# Altium schematic sheet FPGA_SDRAM2.SchDoc: RFSOC_AMC
size 420 x 297 mm; Author: G.Kasprowicz; CompanyName: WUT ISE; DrawnBy: G.Kasprowicz; Organization: WUT ISE; Address1: PW ISE; Address2: Nowowiejska 15/19 00-665 Warsaw; Address3: gkasprow@gmail.com; DocumentNumber: 13; Revision: 2; SheetNumber: 14; SheetTotal: 54; ModifiedBy: -; CheckedDate: -; Title2: 8 channel ADC & DAC; DivGrp: WUT ISE; Designer: G.Kasprowicz; ModifiedDate: -; ProjectName: Sensor Box
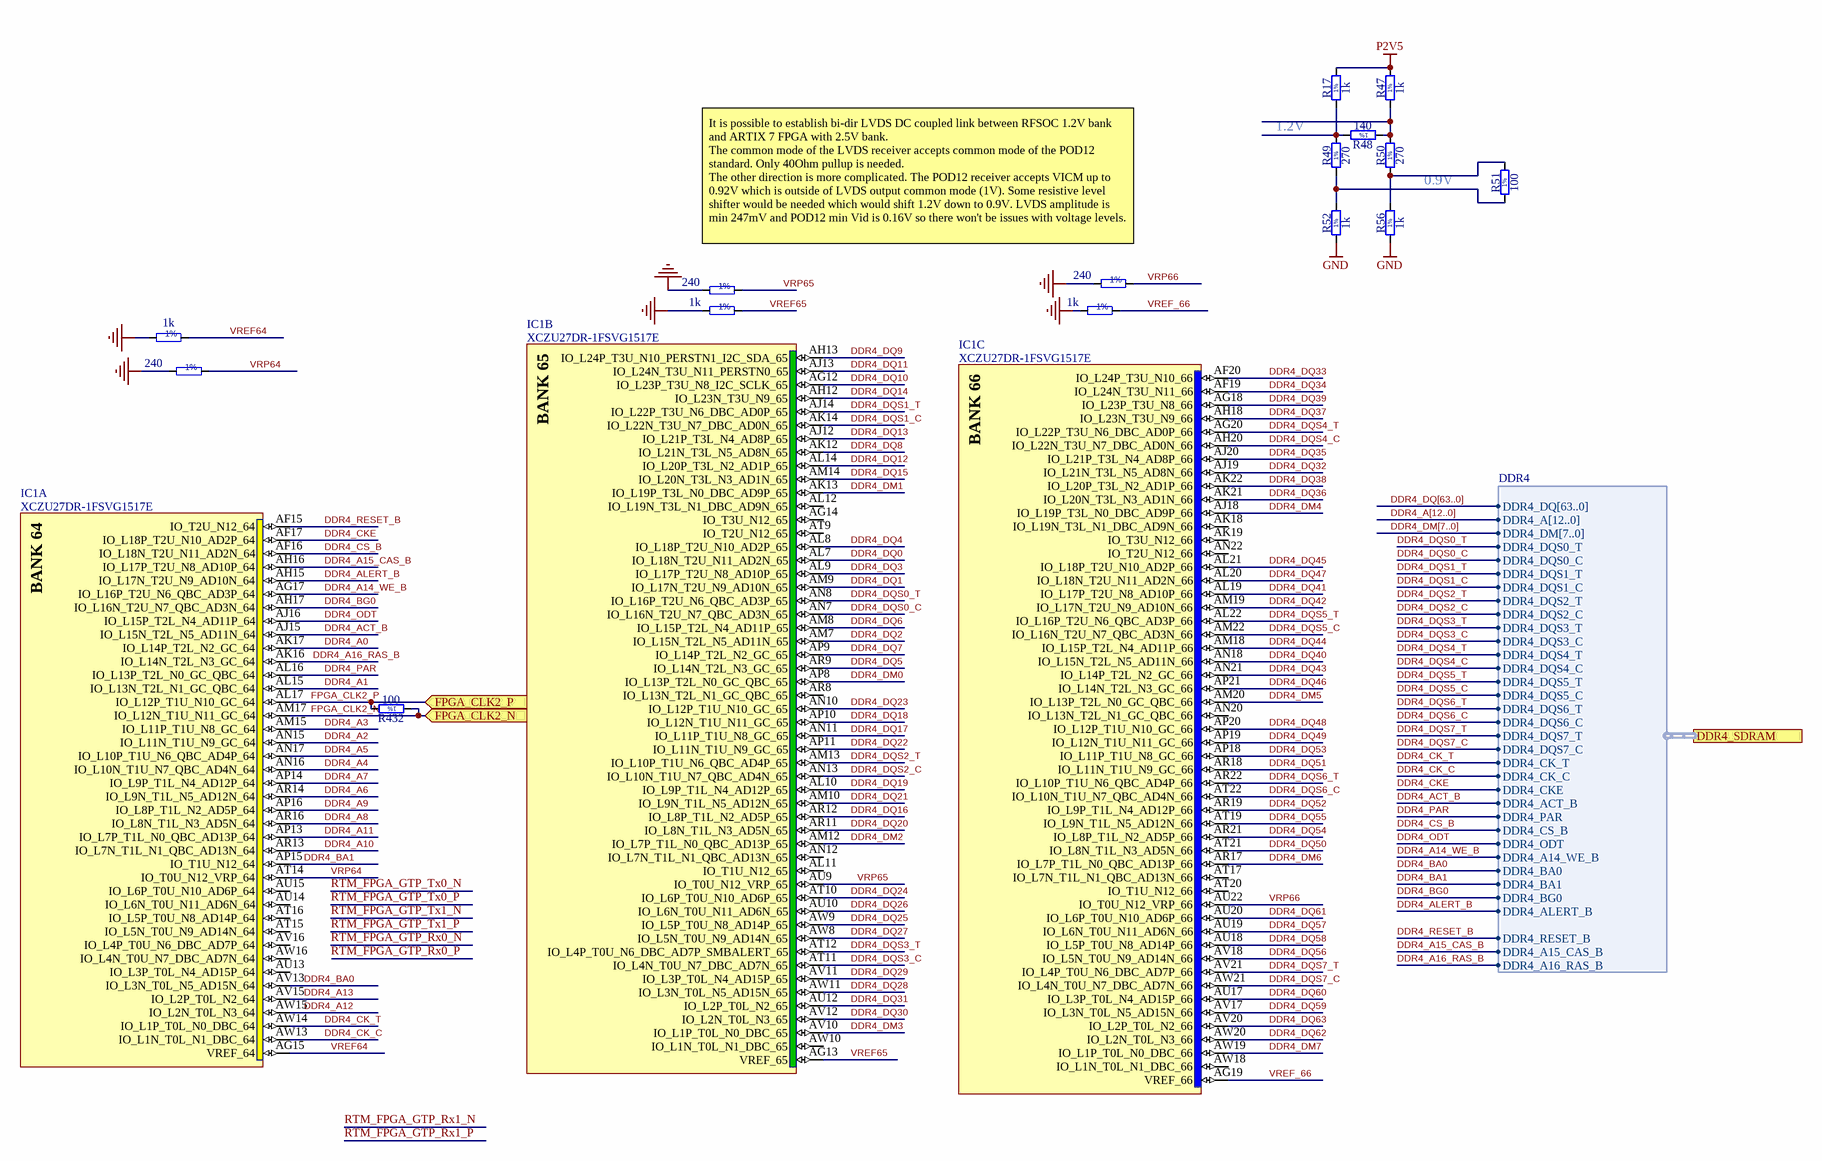
[diagram p0: FPGA_SDRAM2.SchDoc]

## Parts
IC1  XCZU27DR-1FSVG1517E  [XILINX_FSVG1517 (XCZU27DR)]  (parts A,B,C of 31)
R1  1k
R2  240
R3  240
R4  240
R5  1k
R6  1k
R17  1k  [RESC1005X40N]
R47  1k  [RESC1005X40N]
R48  140  [RESC1005X40N]
R49  270  [RESC1005X40N]
R50  270  [RESC1005X40N]
R51  100  [RESC1005X40N]
R52  1k  [RESC1005X40N]
R56  1k  [RESC1005X40N]
R432  100  [RESC1005X40N]

## Ports
DDR4_SDRAM (harness DDR4), FPGA_CLK2_N (in), FPGA_CLK2_P (in)

## Harnesses
DDR4: DDR4_DQ[63..0], DDR4_A[12..0], DDR4_DM[7..0], DDR4_DQS0_T, DDR4_DQS0_C, DDR4_DQS1_T, DDR4_DQS1_C, DDR4_DQS2_T, DDR4_DQS2_C, DDR4_DQS3_T, DDR4_DQS3_C, DDR4_DQS4_T, DDR4_DQS4_C, DDR4_DQS5_T, DDR4_DQS5_C, DDR4_DQS6_T, DDR4_DQS6_C, DDR4_DQS7_T, DDR4_DQS7_C, DDR4_CK_T, DDR4_CK_C, DDR4_CKE, DDR4_ACT_B, DDR4_PAR, DDR4_CS_B, DDR4_ODT, DDR4_A14_WE_B, DDR4_BA0, DDR4_BA1, DDR4_BG0, DDR4_ALERT_B, DDR4_RESET_B, DDR4_A15_CAS_B, DDR4_A16_RAS_B

## Nets
GND: R1.1 R2.1 R3.1 R4.1 R5.1 R6.1 R52.1 R56.1
P2V5: R17.2 R47.2
DDR4_A0: IC1.AK17(IO_L14P_T2L_N2_GC_64)
DDR4_A1: IC1.AL15(IO_L13N_T2L_N1_GC_QBC_64)
DDR4_A2: IC1.AN15(IO_L11N_T1U_N9_GC_64)
DDR4_A3: IC1.AM15(IO_L11P_T1U_N8_GC_64)
DDR4_A4: IC1.AN16(IO_L10N_T1U_N7_QBC_AD4N_64)
DDR4_A5: IC1.AN17(IO_L10P_T1U_N6_QBC_AD4P_64)
DDR4_A6: IC1.AR14(IO_L9N_T1L_N5_AD12N_64)
DDR4_A7: IC1.AP14(IO_L9P_T1L_N4_AD12P_64)
DDR4_A8: IC1.AR16(IO_L8N_T1L_N3_AD5N_64)
DDR4_A9: IC1.AP16(IO_L8P_T1L_N2_AD5P_64)
DDR4_A10: IC1.AR13(IO_L7N_T1L_N1_QBC_AD13N_64)
DDR4_A11: IC1.AP13(IO_L7P_T1L_N0_QBC_AD13P_64)
DDR4_A12: IC1.AW15(IO_L2N_T0L_N3_64)
DDR4_A13: IC1.AV15(IO_L2P_T0L_N2_64)
DDR4_A14_WE_B: IC1.AG17(IO_L16P_T2U_N6_QBC_AD3P_64) ; port DDR4_SDRAM.DDR4_A14_WE_B
DDR4_A15_CAS_B: IC1.AH16(IO_L17P_T2U_N8_AD10P_64) ; port DDR4_SDRAM.DDR4_A15_CAS_B
DDR4_A16_RAS_B: IC1.AK16(IO_L14N_T2L_N3_GC_64) ; port DDR4_SDRAM.DDR4_A16_RAS_B
DDR4_ACT_B: IC1.AJ15(IO_L15N_T2L_N5_AD11N_64) ; port DDR4_SDRAM.DDR4_ACT_B
DDR4_ALERT_B: IC1.AH15(IO_L17N_T2U_N9_AD10N_64) ; port DDR4_SDRAM.DDR4_ALERT_B
DDR4_BA0: IC1.AV13(IO_L3N_T0L_N5_AD15N_64) ; port DDR4_SDRAM.DDR4_BA0
DDR4_BA1: IC1.AP15(IO_T1U_N12_64) ; port DDR4_SDRAM.DDR4_BA1
DDR4_BG0: IC1.AH17(IO_L16N_T2U_N7_QBC_AD3N_64) ; port DDR4_SDRAM.DDR4_BG0
DDR4_CK_C: IC1.AW13(IO_L1N_T0L_N1_DBC_64) ; port DDR4_SDRAM.DDR4_CK_C
DDR4_CK_T: IC1.AW14(IO_L1P_T0L_N0_DBC_64) ; port DDR4_SDRAM.DDR4_CK_T
DDR4_CKE: IC1.AF17(IO_L18P_T2U_N10_AD2P_64) ; port DDR4_SDRAM.DDR4_CKE
DDR4_CS_B: IC1.AF16(IO_L18N_T2U_N11_AD2N_64) ; port DDR4_SDRAM.DDR4_CS_B
DDR4_DM0: IC1.AP8(IO_L13P_T2L_N0_GC_QBC_65)
DDR4_DM1: IC1.AK13(IO_L19P_T3L_N0_DBC_AD9P_65)
DDR4_DM2: IC1.AM12(IO_L7P_T1L_N0_QBC_AD13P_65)
DDR4_DM3: IC1.AV10(IO_L1P_T0L_N0_DBC_65)
DDR4_DM4: IC1.AJ18(IO_L19P_T3L_N0_DBC_AD9P_66)
DDR4_DM5: IC1.AM20(IO_L13P_T2L_N0_GC_QBC_66)
DDR4_DM6: IC1.AR17(IO_L7P_T1L_N0_QBC_AD13P_66)
DDR4_DM7: IC1.AW19(IO_L1P_T0L_N0_DBC_66)
DDR4_DQ0: IC1.AL7(IO_L18N_T2U_N11_AD2N_65)
DDR4_DQ1: IC1.AM9(IO_L17N_T2U_N9_AD10N_65)
DDR4_DQ2: IC1.AM7(IO_L15N_T2L_N5_AD11N_65)
DDR4_DQ3: IC1.AL9(IO_L17P_T2U_N8_AD10P_65)
DDR4_DQ4: IC1.AL8(IO_L18P_T2U_N10_AD2P_65)
DDR4_DQ5: IC1.AR9(IO_L14N_T2L_N3_GC_65)
DDR4_DQ6: IC1.AM8(IO_L15P_T2L_N4_AD11P_65)
DDR4_DQ7: IC1.AP9(IO_L14P_T2L_N2_GC_65)
DDR4_DQ8: IC1.AK12(IO_L21N_T3L_N5_AD8N_65)
DDR4_DQ9: IC1.AH13(IO_L24P_T3U_N10_PERSTN1_I2C_SDA_65)
DDR4_DQ10: IC1.AG12(IO_L23P_T3U_N8_I2C_SCLK_65)
DDR4_DQ11: IC1.AJ13(IO_L24N_T3U_N11_PERSTN0_65)
DDR4_DQ12: IC1.AL14(IO_L20P_T3L_N2_AD1P_65)
DDR4_DQ13: IC1.AJ12(IO_L21P_T3L_N4_AD8P_65)
DDR4_DQ14: IC1.AH12(IO_L23N_T3U_N9_65)
DDR4_DQ15: IC1.AM14(IO_L20N_T3L_N3_AD1N_65)
DDR4_DQ16: IC1.AR12(IO_L8P_T1L_N2_AD5P_65)
DDR4_DQ17: IC1.AN11(IO_L11P_T1U_N8_GC_65)
DDR4_DQ18: IC1.AP10(IO_L12N_T1U_N11_GC_65)
DDR4_DQ19: IC1.AL10(IO_L9P_T1L_N4_AD12P_65)
DDR4_DQ20: IC1.AR11(IO_L8N_T1L_N3_AD5N_65)
DDR4_DQ21: IC1.AM10(IO_L9N_T1L_N5_AD12N_65)
DDR4_DQ22: IC1.AP11(IO_L11N_T1U_N9_GC_65)
DDR4_DQ23: IC1.AN10(IO_L12P_T1U_N10_GC_65)
DDR4_DQ24: IC1.AT10(IO_L6P_T0U_N10_AD6P_65)
DDR4_DQ25: IC1.AW9(IO_L5P_T0U_N8_AD14P_65)
DDR4_DQ26: IC1.AU10(IO_L6N_T0U_N11_AD6N_65)
DDR4_DQ27: IC1.AW8(IO_L5N_T0U_N9_AD14N_65)
DDR4_DQ28: IC1.AW11(IO_L3N_T0L_N5_AD15N_65)
DDR4_DQ29: IC1.AV11(IO_L3P_T0L_N4_AD15P_65)
DDR4_DQ30: IC1.AV12(IO_L2N_T0L_N3_65)
DDR4_DQ31: IC1.AU12(IO_L2P_T0L_N2_65)
DDR4_DQ32: IC1.AJ19(IO_L21N_T3L_N5_AD8N_66)
DDR4_DQ33: IC1.AF20(IO_L24P_T3U_N10_66)
DDR4_DQ34: IC1.AF19(IO_L24N_T3U_N11_66)
DDR4_DQ35: IC1.AJ20(IO_L21P_T3L_N4_AD8P_66)
DDR4_DQ36: IC1.AK21(IO_L20N_T3L_N3_AD1N_66)
DDR4_DQ37: IC1.AH18(IO_L23N_T3U_N9_66)
DDR4_DQ38: IC1.AK22(IO_L20P_T3L_N2_AD1P_66)
DDR4_DQ39: IC1.AG18(IO_L23P_T3U_N8_66)
DDR4_DQ40: IC1.AN18(IO_L15N_T2L_N5_AD11N_66)
DDR4_DQ41: IC1.AL19(IO_L17P_T2U_N8_AD10P_66)
DDR4_DQ42: IC1.AM19(IO_L17N_T2U_N9_AD10N_66)
DDR4_DQ43: IC1.AN21(IO_L14P_T2L_N2_GC_66)
DDR4_DQ44: IC1.AM18(IO_L15P_T2L_N4_AD11P_66)
DDR4_DQ45: IC1.AL21(IO_L18P_T2U_N10_AD2P_66)
DDR4_DQ46: IC1.AP21(IO_L14N_T2L_N3_GC_66)
DDR4_DQ47: IC1.AL20(IO_L18N_T2U_N11_AD2N_66)
DDR4_DQ48: IC1.AP20(IO_L12P_T1U_N10_GC_66)
DDR4_DQ49: IC1.AP19(IO_L12N_T1U_N11_GC_66)
DDR4_DQ50: IC1.AT21(IO_L8N_T1L_N3_AD5N_66)
DDR4_DQ51: IC1.AR18(IO_L11N_T1U_N9_GC_66)
DDR4_DQ52: IC1.AR19(IO_L9P_T1L_N4_AD12P_66)
DDR4_DQ53: IC1.AP18(IO_L11P_T1U_N8_GC_66)
DDR4_DQ54: IC1.AR21(IO_L8P_T1L_N2_AD5P_66)
DDR4_DQ55: IC1.AT19(IO_L9N_T1L_N5_AD12N_66)
DDR4_DQ56: IC1.AV18(IO_L5N_T0U_N9_AD14N_66)
DDR4_DQ57: IC1.AU19(IO_L6N_T0U_N11_AD6N_66)
DDR4_DQ58: IC1.AU18(IO_L5P_T0U_N8_AD14P_66)
DDR4_DQ59: IC1.AV17(IO_L3N_T0L_N5_AD15N_66)
DDR4_DQ60: IC1.AU17(IO_L3P_T0L_N4_AD15P_66)
DDR4_DQ61: IC1.AU20(IO_L6P_T0U_N10_AD6P_66)
DDR4_DQ62: IC1.AW20(IO_L2N_T0L_N3_66)
DDR4_DQ63: IC1.AV20(IO_L2P_T0L_N2_66)
DDR4_DQS0_C: IC1.AN7(IO_L16N_T2U_N7_QBC_AD3N_65) ; port DDR4_SDRAM.DDR4_DQS0_C
DDR4_DQS0_T: IC1.AN8(IO_L16P_T2U_N6_QBC_AD3P_65) ; port DDR4_SDRAM.DDR4_DQS0_T
DDR4_DQS1_C: IC1.AK14(IO_L22N_T3U_N7_DBC_AD0N_65) ; port DDR4_SDRAM.DDR4_DQS1_C
DDR4_DQS1_T: IC1.AJ14(IO_L22P_T3U_N6_DBC_AD0P_65) ; port DDR4_SDRAM.DDR4_DQS1_T
DDR4_DQS2_C: IC1.AN13(IO_L10N_T1U_N7_QBC_AD4N_65) ; port DDR4_SDRAM.DDR4_DQS2_C
DDR4_DQS2_T: IC1.AM13(IO_L10P_T1U_N6_QBC_AD4P_65) ; port DDR4_SDRAM.DDR4_DQS2_T
DDR4_DQS3_C: IC1.AT11(IO_L4N_T0U_N7_DBC_AD7N_65) ; port DDR4_SDRAM.DDR4_DQS3_C
DDR4_DQS3_T: IC1.AT12(IO_L4P_T0U_N6_DBC_AD7P_SMBALERT_65) ; port DDR4_SDRAM.DDR4_DQS3_T
DDR4_DQS4_C: IC1.AH20(IO_L22N_T3U_N7_DBC_AD0N_66) ; port DDR4_SDRAM.DDR4_DQS4_C
DDR4_DQS4_T: IC1.AG20(IO_L22P_T3U_N6_DBC_AD0P_66) ; port DDR4_SDRAM.DDR4_DQS4_T
DDR4_DQS5_C: IC1.AM22(IO_L16N_T2U_N7_QBC_AD3N_66) ; port DDR4_SDRAM.DDR4_DQS5_C
DDR4_DQS5_T: IC1.AL22(IO_L16P_T2U_N6_QBC_AD3P_66) ; port DDR4_SDRAM.DDR4_DQS5_T
DDR4_DQS6_C: IC1.AT22(IO_L10N_T1U_N7_QBC_AD4N_66) ; port DDR4_SDRAM.DDR4_DQS6_C
DDR4_DQS6_T: IC1.AR22(IO_L10P_T1U_N6_QBC_AD4P_66) ; port DDR4_SDRAM.DDR4_DQS6_T
DDR4_DQS7_C: IC1.AW21(IO_L4N_T0U_N7_DBC_AD7N_66) ; port DDR4_SDRAM.DDR4_DQS7_C
DDR4_DQS7_T: IC1.AV21(IO_L4P_T0U_N6_DBC_AD7P_66) ; port DDR4_SDRAM.DDR4_DQS7_T
DDR4_ODT: IC1.AJ16(IO_L15P_T2L_N4_AD11P_64) ; port DDR4_SDRAM.DDR4_ODT
DDR4_PAR: IC1.AL16(IO_L13P_T2L_N0_GC_QBC_64) ; port DDR4_SDRAM.DDR4_PAR
DDR4_RESET_B: IC1.AF15(IO_T2U_N12_64) ; port DDR4_SDRAM.DDR4_RESET_B
FPGA_CLK2_N: IC1.AM17(IO_L12N_T1U_N11_GC_64) R432.2 ; port FPGA_CLK2_N
FPGA_CLK2_P: IC1.AL17(IO_L12P_T1U_N10_GC_64) R432.1 ; port FPGA_CLK2_P
VREF64: IC1.AG15(VREF_64) R1.2
VREF65: IC1.AG13(VREF_65) R5.2
VREF_66: IC1.AG19(VREF_66) R6.2
VRP64: IC1.AT14(IO_T0U_N12_VRP_64) R4.2
VRP65: IC1.AU9(IO_T0U_N12_VRP_65) R3.2
VRP66: IC1.AU22(IO_T0U_N12_VRP_66) R2.2
NetR17_1: R17.1 R48.2 R49.2
NetR47_1: R47.1 R48.1 R50.2
NetR49_1: R49.1 R51.1 R52.2
NetR50_1: R50.1 R51.2 R56.2

Not connected (* = marked no-connect by the designer): IC1 AG14(IO_T3U_N12_65) AK18(IO_L19N_T3L_N1_DBC_AD9N_66) AK19(IO_T3U_N12_66) AL11(IO_T1U_N12_65) AL12(IO_L19N_T3L_N1_DBC_AD9N_65) AN12(IO_L7N_T1L_N1_QBC_AD13N_65) AN20(IO_L13N_T2L_N1_GC_QBC_66) AN22(IO_T2U_N12_66) AR8(IO_L13N_T2L_N1_GC_QBC_65) AT9(IO_T2U_N12_65) AT15(IO_L5N_T0U_N9_AD14N_64) AT16(IO_L5P_T0U_N8_AD14P_64) AT17(IO_L7N_T1L_N1_QBC_AD13N_66) AT20(IO_T1U_N12_66) AU13(IO_L3P_T0L_N4_AD15P_64) AU14(IO_L6N_T0U_N11_AD6N_64) AU15(IO_L6P_T0U_N10_AD6P_64) AV16(IO_L4P_T0U_N6_DBC_AD7P_64) AW10(IO_L1N_T0L_N1_DBC_65) AW16(IO_L4N_T0U_N7_DBC_AD7N_64) AW18(IO_L1N_T0L_N1_DBC_66)

## Buses and harness runs
bus DDR4_A[12..0]
bus DDR4_DM[7..0]
bus DDR4_DQ[63..0]

## Notes on the sheet
- 1.2V
- It is possible to establish bi-dir LVDS DC coupled link between RFSOC 1.2V bank and ARTIX 7 FPGA with 2.5V bank.
  The common mode of the LVDS receiver accepts common mode of the POD12 standard. Only 40Ohm pullup is needed.
  The other direction is more complicated. The POD12 receiver accepts VICM up to 0.92V which is outside of LVDS output common mode (1V). Some resistive level shifter would be needed which would shift 1.2V down to 0.9V. LVDS amplitude is min 247mV and POD12 min Vid is 0.16V so there won't be issues with voltage levels.
- 0.9V
- Labels drawn without touching a wire or pin: RTM_FPGA_GTP_Rx0_P
- Project/Equipment
- Document
- Designer
- Drawn by
- Check.by
- Copyright WUT ISE 2019.
  This documentation describes Open Hardware and is licensed under the CERN OHL v.1.1. You may redistribute and modify this documentation under the terms of the CERN OHL v.1.1. (http://ohwr.org/CERNOHL). This documentation is distributed WITHOUT ANY EXPRESS OR IMPLIED WARRANTY, INCLUDING OF MERCHANTABILITY, SATISFACTORY QUALITY AND FITNESS FOR A PARTICULAR PURPOSE. Please see the CERN OHL v.1.1 for applicable conditions.
- Contact
- File
- Last Mod.
- Print Date
- Sheet
- Size
- A3
- of
- Rev
- (in symbol R1) 1%
- (in symbol R2) 1%
- (in symbol R3) 1%
- (in symbol R4) 1%
- (in symbol R5) 1%
- (in symbol R6) 1%
- (in symbol R0402_1K_1%_0.0625W_100PPM) 1%
- (in symbol R0402_100R_1%_0.0625W_100PPM) 1%
- (in symbol R0402_140R_1%_0.0625W_100PPM) 1%
- (in symbol R0402_270R_1%_0.0625W_100PPM) 1%
- (in symbol XCZU27DR-1FSVG1517E, part A) BANK 64
- (in symbol XCZU27DR-1FSVG1517E, part B) BANK 65
- (in symbol XCZU27DR-1FSVG1517E, part C) BANK 66

## Library data of the parts
IC1 = XCZU27DR-1FSVG1517E: Zynq UltraScale+ RFSoC, Quad-Core ARM® Cortex™-A53 MPCore™ up to 1.5GHz, 214 PS I/O, 299 HP I/O, 48 HD I/O, 1517-Pin BGA; Manufacturer: XILINX; PressFit: No; Bonding: No; Part Number: XCZU27DR-1FSVG1517E; Component Kind: Standard; Component Type: Standard; Device: XCZU27DR-1FSVG1517E; PackageDescription: BGA, 1.00mm Pitch, Square; 1517 Pin, 39 Columns X 39 Rows, 40.00mm X 40.00mm X 4.01mm H; Part Description: Zynq UltraScale+ RFSoC, Quad-Core ARM® Cortex™-A53 MPCore™ up to 1.5GHz, 214 PS I/O, 299 HP I/O, 48 HD I/O, 1517-Pin BGA; Manufacturer Part Number: XCZU27DR-1FSVG1517E; Pin Count: 1517; Case: BGA1517; Mounted: Yes; Socket: No; SMD: Yes; Sense: No; ComponentHeight: 4.01mm; HelpURL: \\cern.ch\dfs\Applications\Altium\Datasheets\XCZU27DR-1FSVG1517E.pdf; ComponentLink1URL: \\cern.ch\dfs\Applications\Altium\Datasheets\XCZU27DR-1FSVG1517E_Package-Pinout.pdf; ComponentLink1Description: Package/Pinout; ComponentLink2URL: \\cern.ch\dfs\Applications\Altium\Datasheets\XCZU27DR-1FSVG1517E_Pinout.pdf; ComponentLink2Description: Pinout; Author: CERN DEM MR; CreateDate: 02/05/2018; LatestRevisionDate: 02/05/2018
R1 = (no symbol name): $$NotCommonProperty_General Part Number: R0402_1K_1%_0.0625W_100PPM; $$NotCommonProperty_Manufacturer1 Example: YAGEO PHYCOMP; $$NotCommonProperty_Manufacturer1 Part Number: 232270671002L; Manufacturer: GENERIC; Part Description: General Purpose Thick Film Chip Resistor; Part Name: Resistor - 1% RESC1005X40N; $$Internal_Resolution: 00001mm; $$NotCommonProperty_Case: 0402; $$NotCommonProperty_Pin Count: 2; $$NotCommonProperty_Power: 0.0625W; $$NotCommonProperty_Sense: No; $$NotCommonProperty_SMD: Yes; $$NotCommonProperty_Status: Not recommended; $$NotCommonProperty_TC: ±100ppm/°C; Cell Name: RESC1005X40N; CmpIndex: 535; DXDB_LIBNAME: Resistors SMD; Ref Designator: R400; SymIndex: 317; Tolerance: ±1%; $$Internal___BlkDate: 18:43:16_11-19-16; $$NotCommonProperty_Manufacturer1 ComponentHeight: 0.4mm; Manufacturer Part Number: R0402_1K_1%_0.0625W_100PPM; Part Number: Resistor - 1% RESC1005X40N; Value: 1k; Orientation: 0 = 0
R2 = (no symbol name): $$NotCommonProperty_General Part Number: R0402_240R_1%_0.0625W_100PPM; $$NotCommonProperty_Manufacturer1 Example: YAGEO PHYCOMP; $$NotCommonProperty_Manufacturer1 Part Number: 232270672401L; Manufacturer: GENERIC; Part Description: General Purpose Thick Film Chip Resistor; Part Name: Resistor - 1% RESC1005X40N; $$Internal_Resolution: 00001mm; $$NotCommonProperty_Case: 0402; $$NotCommonProperty_Cell: RESC1005X40N; $$NotCommonProperty_Pin Count: 2; $$NotCommonProperty_Power: 0.0625W; $$NotCommonProperty_Sense: No; $$NotCommonProperty_SMD: Yes; $$NotCommonProperty_Status: Not recommended; $$NotCommonProperty_TC: ±100ppm/°C; CmpIndex: 237; DXDB_LIBNAME: Resistors SMD; Ref Designator: R295; SymIndex: 317; Tolerance: ±1%; $$Internal___BlkDate: 18:43:16_11-19-16; $$NotCommonProperty_Manufacturer1 ComponentHeight: 0.4mm; Cell Name: RESC1005X40N; Manufacturer Part Number: R0402_240R_1%_0.0625W_100PPM; Part Number: Resistor - 1% RESC1005X40N; Value: 240; Orientation: 0 = 0
R3 = (no symbol name): $$NotCommonProperty_General Part Number: R0402_240R_1%_0.0625W_100PPM; $$NotCommonProperty_Manufacturer1 Example: YAGEO PHYCOMP; $$NotCommonProperty_Manufacturer1 Part Number: 232270672401L; Manufacturer: GENERIC; Part Description: General Purpose Thick Film Chip Resistor; Part Name: Resistor - 1% RESC1005X40N; $$Internal_Resolution: 00001mm; $$NotCommonProperty_Case: 0402; $$NotCommonProperty_Cell: RESC1005X40N; $$NotCommonProperty_Pin Count: 2; $$NotCommonProperty_Power: 0.0625W; $$NotCommonProperty_Sense: No; $$NotCommonProperty_SMD: Yes; $$NotCommonProperty_Status: Not recommended; $$NotCommonProperty_TC: ±100ppm/°C; CmpIndex: 235; DXDB_LIBNAME: Resistors SMD; Ref Designator: R294; SymIndex: 317; Tolerance: ±1%; $$Internal___BlkDate: 18:43:16_11-19-16; $$NotCommonProperty_Manufacturer1 ComponentHeight: 0.4mm; Cell Name: RESC1005X40N; Manufacturer Part Number: R0402_240R_1%_0.0625W_100PPM; Part Number: Resistor - 1% RESC1005X40N; Value: 240; Orientation: 0 = 0
R4 = (no symbol name): $$NotCommonProperty_General Part Number: R0402_240R_1%_0.0625W_100PPM; $$NotCommonProperty_Manufacturer1 Example: YAGEO PHYCOMP; $$NotCommonProperty_Manufacturer1 Part Number: 232270672401L; Manufacturer: GENERIC; Part Description: General Purpose Thick Film Chip Resistor; Part Name: Resistor - 1% RESC1005X40N; $$Internal_Resolution: 00001mm; $$NotCommonProperty_Case: 0402; $$NotCommonProperty_Cell: RESC1005X40N; $$NotCommonProperty_Pin Count: 2; $$NotCommonProperty_Power: 0.0625W; $$NotCommonProperty_Sense: No; $$NotCommonProperty_SMD: Yes; $$NotCommonProperty_Status: Not recommended; $$NotCommonProperty_TC: ±100ppm/°C; CmpIndex: 232; DXDB_LIBNAME: Resistors SMD; Ref Designator: R293; SymIndex: 317; Tolerance: ±1%; $$Internal___BlkDate: 18:43:16_11-19-16; $$NotCommonProperty_Manufacturer1 ComponentHeight: 0.4mm; Cell Name: RESC1005X40N; Manufacturer Part Number: R0402_240R_1%_0.0625W_100PPM; Part Number: Resistor - 1% RESC1005X40N; Value: 240; Orientation: 0 = 0
R5 = (no symbol name): $$NotCommonProperty_General Part Number: R0402_1K_1%_0.0625W_100PPM; $$NotCommonProperty_Manufacturer1 Example: YAGEO PHYCOMP; $$NotCommonProperty_Manufacturer1 Part Number: 232270671002L; Manufacturer: GENERIC; Part Description: General Purpose Thick Film Chip Resistor; Part Name: Resistor - 1% RESC1005X40N; $$Internal_Resolution: 00001mm; $$NotCommonProperty_Case: 0402; $$NotCommonProperty_Pin Count: 2; $$NotCommonProperty_Power: 0.0625W; $$NotCommonProperty_Sense: No; $$NotCommonProperty_SMD: Yes; $$NotCommonProperty_Status: Not recommended; $$NotCommonProperty_TC: ±100ppm/°C; Cell Name: RESC1005X40N; CmpIndex: 538; DXDB_LIBNAME: Resistors SMD; Ref Designator: R451; SymIndex: 317; Tolerance: ±1%; $$Internal___BlkDate: 18:43:16_11-19-16; $$NotCommonProperty_Manufacturer1 ComponentHeight: 0.4mm; Manufacturer Part Number: R0402_1K_1%_0.0625W_100PPM; Part Number: Resistor - 1% RESC1005X40N; Value: 1k; Orientation: 0 = 0
R6 = (no symbol name): $$NotCommonProperty_General Part Number: R0402_1K_1%_0.0625W_100PPM; $$NotCommonProperty_Manufacturer1 Example: YAGEO PHYCOMP; $$NotCommonProperty_Manufacturer1 Part Number: 232270671002L; Manufacturer: GENERIC; Part Description: General Purpose Thick Film Chip Resistor; Part Name: Resistor - 1% RESC1005X40N; $$Internal_Resolution: 00001mm; $$NotCommonProperty_Case: 0402; $$NotCommonProperty_Pin Count: 2; $$NotCommonProperty_Power: 0.0625W; $$NotCommonProperty_Sense: No; $$NotCommonProperty_SMD: Yes; $$NotCommonProperty_Status: Not recommended; $$NotCommonProperty_TC: ±100ppm/°C; Cell Name: RESC1005X40N; CmpIndex: 62; DXDB_LIBNAME: Resistors SMD; Ref Designator: R452; SymIndex: 317; Tolerance: ±1%; $$Internal___BlkDate: 18:43:16_11-19-16; $$NotCommonProperty_Manufacturer1 ComponentHeight: 0.4mm; Manufacturer Part Number: R0402_1K_1%_0.0625W_100PPM; Part Number: Resistor - 1% RESC1005X40N; Value: 1k; Orientation: 0 = 0
R17 R47 R52 R56 = R0402_1K_1%_0.0625W_100PPM: Resistor - 1%; Part Description: General Purpose Thick Film Chip Resistor; Manufacturer: GENERIC; Manufacturer1 Part Number: 232270671002L; TC: ±100ppm/°C; PressFit: No; Part Number: R0402_1K_1%_0.0625W_100PPM; Component Kind: Standard; Component Type: Standard; Pin Count: 2; Value: 1k; Status: Not Recommended; Power: 0.0625W; Tolerance: ±1%; Manufacturer Part Number: R0402_1K_1%_0.0625W_100PPM; Case: 0402; Mounted: Yes; Sense: No; Socket: No; SMD: Yes; Manufacturer1 Example: YAGEO PHYCOMP; Manufacturer1 ComponentHeight: 0.4mm; HelpURL: \\cern.ch\dfs\Applications\Altium\Datasheets\R0402_Phycomp_RC0402.pdf; Author: CERN DEM JLC; CreateDate: 03/12/2007; LatestRevisionDate: 17/10/2012
R48 = R0402_140R_1%_0.0625W_100PPM: Resistor - 1%; Part Description: General Purpose Thick Film Chip Resistor; Manufacturer: GENERIC; Manufacturer1 Part Number: 232270671401L or RC0402FR-07140RL; TC: ±100ppm/°C; PressFit: No; Part Number: R0402_140R_1%_0.0625W_100PPM; Component Kind: Standard; Component Type: Standard; Pin Count: 2; Value: 140; Status: Not Recommended; Power: 0.0625W; Tolerance: ±1%; Manufacturer Part Number: R0402_140R_1%_0.0625W_100PPM; Case: 0402; Mounted: Yes; Sense: No; Socket: No; SMD: Yes; Manufacturer1 Example: YAGEO PHYCOMP; Manufacturer1 ComponentHeight: 0.4mm; HelpURL: \\cern.ch\dfs\Applications\Altium\Datasheets\R0402_Phycomp_RC0402.pdf; Author: CERN DEM BC; CreateDate: 29/07/2015; LatestRevisionDate: 29/07/2015
R49 R50 = R0402_270R_1%_0.0625W_100PPM: Resistor - 1%; Part Description: General Purpose Thick Film Chip Resistor; Manufacturer: GENERIC; Manufacturer1 Part Number: 232270672701L; TC: ±100ppm/°C; PressFit: No; Part Number: R0402_270R_1%_0.0625W_100PPM; Component Kind: Standard; Component Type: Standard; Pin Count: 2; Value: 270; Status: Not Recommended; Power: 0.0625W; Tolerance: ±1%; Manufacturer Part Number: R0402_270R_1%_0.0625W_100PPM; Case: 0402; Mounted: Yes; Sense: No; Socket: No; SMD: Yes; Manufacturer1 Example: YAGEO PHYCOMP; Manufacturer1 ComponentHeight: 0.4mm; HelpURL: \\cern.ch\dfs\Applications\Altium\Datasheets\R0402_Phycomp_RC0402.pdf; Author: CERN DEM JLC; CreateDate: 03/12/2007; LatestRevisionDate: 17/10/2012
R51 = R0402_100R_1%_0.0625W_100PPM: Resistor - 1%; Part Description: General Purpose Thick Film Chip Resistor; Manufacturer: GENERIC; Manufacturer1 Part Number: 232270671001L; TC: ±100ppm/°C; PressFit: No; Part Number: R0402_100R_1%_0.0625W_100PPM; Component Kind: Standard; Component Type: Standard; Pin Count: 2; Value: 100; Status: Not Recommended; Power: 0.0625W; Tolerance: ±1%; Manufacturer Part Number: R0402_100R_1%_0.0625W_100PPM; Case: 0402; Mounted: Yes; Sense: No; Socket: No; SMD: Yes; Manufacturer1 Example: YAGEO PHYCOMP; Manufacturer1 ComponentHeight: 0.4mm; HelpURL: \\cern.ch\dfs\Applications\Altium\Datasheets\R0402_Phycomp_RC0402.pdf; Author: CERN DEM JLC; CreateDate: 03/12/2007; LatestRevisionDate: 17/10/2012
R432 = R0402_100R_1%_0.0625W_100PPM: Resistor - 1%; Manufacturer: GENERIC; Part Description: General Purpose Thick Film Chip Resistor; Manufacturer1 Part Number: 232270671001L; TC: ±100ppm/°C; PressFit: No; Manufacturer Part Number: R0402_100R_1%_0.0625W_100PPM; Part Number: R0402_100R_1%_0.0625W_100PPM; Tolerance: ±1%; Value: 100; Component Kind: Standard; Component Type: Standard; Pin Count: 2; Status: Not Recommended; Power: 0.0625W; Case: 0402; Mounted: Yes; Sense: No; Socket: No; SMD: Yes; Manufacturer1 Example: YAGEO PHYCOMP; Manufacturer1 ComponentHeight: 0.4mm; HelpURL: \\cern.ch\dfs\Applications\Altium\Datasheets\R0402_Phycomp_RC0402.pdf; Author: CERN DEM JLC; CreateDate: 03/12/2007; LatestRevisionDate: 17/10/2012